# EAGLE design STM32USBInterface (EAGLE 9.6.2)
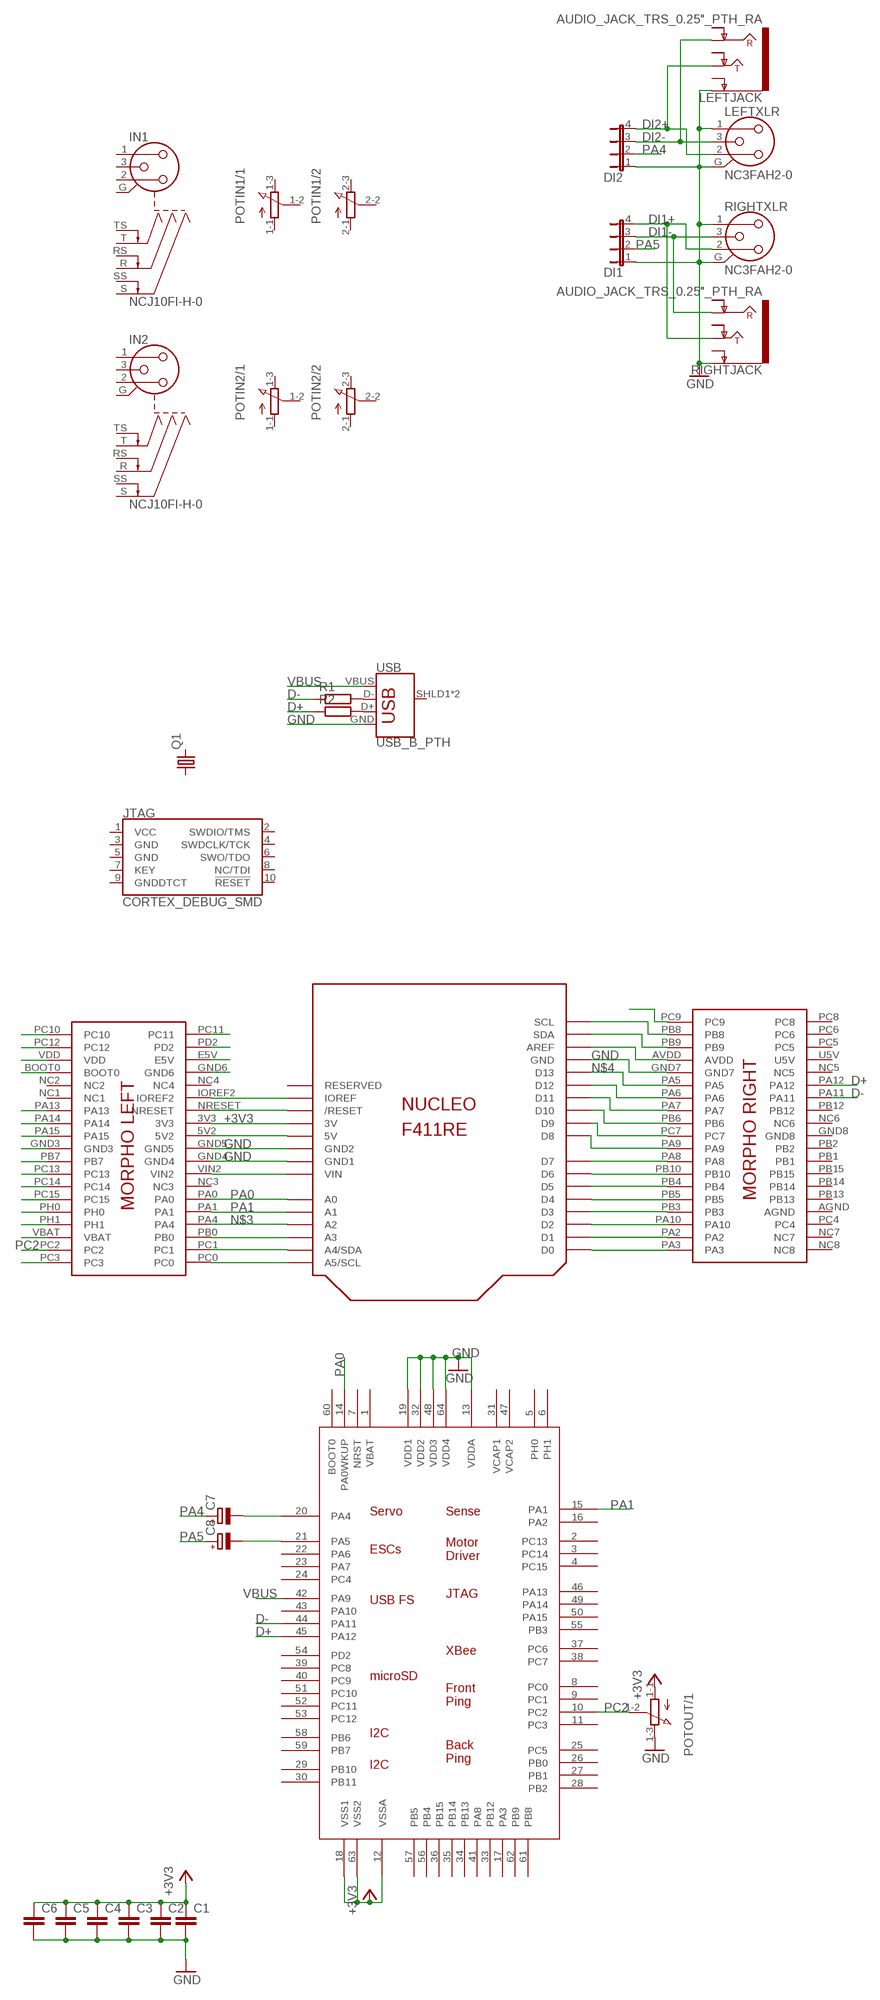
[diagram p0: schematic, sheet 1]

## Parts
C1  C-EUC0805  [C0805]
C2  C-EUC0805  [C0805]
C3  C-EUC0805  [C0805]
C4  C-EUC0805  [C0805]
C5  C-EUC0805  [C0805]
C6  C-EUC0805  [C0805]
C7  CPOL-EUE5-8.5  [E5-8,5]
C8  CPOL-EUE5-8.5  [E5-8,5]
DI1  JP4E  [JP4]
DI2  JP4E  [JP4]
IN1  NCJ10FI-H-0  [NCJ10FI-H-0]
IN2  NCJ10FI-H-0  [NCJ10FI-H-0]
JTAG  CORTEX_DEBUG_SMD  [SAMTECH_FTSH-105-01]
LEFTJACK  AUDIO_JACK_TRS_0.25"_PTH_RA  [AUDIO_JACK_0.25"_TRS_PTH_RA]
LEFTXLR  NC3FAH2-0  [NC3FAH2-0]
POTIN1  3RP/1610G  [3RP/1610G]
POTIN2  3RP/1610G  [3RP/1610G]
POTOUT  3RP/1610G  [3RP/1610G]
Q1  CRYSTALCTS406  [CTS406]
R1  R-EU_R0805  [R0805]
R2  R-EU_R0805  [R0805]
RIGHTJACK  AUDIO_JACK_TRS_0.25"_PTH_RA  [AUDIO_JACK_0.25"_TRS_PTH_RA]
RIGHTXLR  NC3FAH2-0  [NC3FAH2-0]
U$1  NUCLEO_F411RE  [NUCLEO_BRD64]
U$2  STM32F4R_64PIN_FOXCAR  [LQFP64]
USB  USB_B_PTH  [USB-B-PTH]

## Nets
+3V3: C1.1 C2.1 C3.1 C4.1 C5.1 C6.1 POTOUT.1-1(/1:A) U$1.3V U$1.3V3 U$2.12(VSSA) U$2.18(VSS1) U$2.63(VSS2)
D+: R2.1 U$1.PA12 U$2.45(PA12)
D-: R1.1 U$1.PA11 U$2.44(PA11)
DI1+: DI1.4 RIGHTJACK.TIP RIGHTXLR.2
DI1-: DI1.3 RIGHTJACK.RING RIGHTXLR.3
DI2+: DI2.4 LEFTJACK.TIP LEFTXLR.2
DI2-: DI2.3 LEFTJACK.RING LEFTXLR.3
GND: C1.2 C2.2 C3.2 C4.2 C5.2 C6.2 DI1.1 DI2.1 LEFTJACK.SLEEVE(EARTH) LEFTXLR.1 LEFTXLR.G POTOUT.1-3(/1:E) RIGHTJACK.SLEEVE(EARTH) RIGHTXLR.1 RIGHTXLR.G U$1.GND U$1.GND1 U$1.GND2 U$1.GND4 U$1.GND5 U$1.GND7 U$2.13(VDDA) U$2.19(VDD1) U$2.32(VDD2) U$2.48(VDD3) U$2.64(VDD4) USB.GND
N$1: R1.2 USB.D-
N$2: R2.2 USB.D+
N$3: C7.- U$1.A2 U$1.PA4 U$2.20(PA4)
N$4: C8.- U$1.D13 U$1.PA5 U$2.21(PA5)
N$6: U$1.A3 U$1.PB0
N$7: U$1.A4(A4/SDA) U$1.PC1
N$8: U$1.A5(A5/SCL) U$1.PC0
N$9: U$1.VIN U$1.VIN2
N$12: U$1.5V U$1.5V2
N$14: U$1.NRESET U$1.RESET(/RESET)
N$15: U$1.IOREF U$1.IOREF2
N$16: U$1.D0 U$1.PA3
N$17: U$1.D1 U$1.PA2
N$18: U$1.D2 U$1.PA10
N$19: U$1.D3 U$1.PB3
N$20: U$1.D4 U$1.PB5
N$21: U$1.D5 U$1.PB4
N$22: U$1.D6 U$1.PB10
N$23: U$1.D7 U$1.PA8
N$24: U$1.D8 U$1.PA9
N$25: U$1.D9 U$1.PC7
N$26: U$1.D10 U$1.PB6
N$27: U$1.D11 U$1.PA7
N$28: U$1.D12 U$1.PA6
N$31: U$1.AREF U$1.AVDD
N$32: U$1.PB9 U$1.SDA
N$33: U$1.PB8 U$1.SCL
N$34: U$1.PC9
N$35: U$1.GND6
N$36: U$1.E5V
N$37: U$1.PD2
N$38: U$1.PC11
N$39: U$1.PC10
N$40: U$1.PC12
N$41: U$1.VDD
N$42: U$1.BOOT0
N$43: U$1.PA13
N$44: U$1.PA14
N$45: U$1.PA15
N$46: U$1.GND3
N$47: U$1.PB7
N$48: U$1.PC13
N$49: U$1.PC14
N$50: U$1.PC15
N$51: U$1.PH0
N$52: U$1.PH1
N$53: U$1.VBAT
N$55: U$1.PC3
PA0: U$1.A0 U$1.PA0 U$2.14(PA0WKUP)
PA1: U$1.A1 U$1.PA1 U$2.15(PA1)
PA4: C7.+ DI2.2
PA5: C8.+ DI1.2
PC2: POTOUT.1-2(/1:S) U$1.PC2 U$2.10(PC2)
VBUS: U$2.42(PA9) USB.VBUS
Unconnected: IN1.1 IN1.2 IN1.3 IN1.G IN1.R IN1.RS IN1.S IN1.SS IN1.T IN1.TS IN2.1 IN2.2 IN2.3 IN2.G IN2.R IN2.RS IN2.S IN2.SS IN2.T IN2.TS JTAG.1(VCC) JTAG.2(SWDIO/TMS) JTAG.3(GND) JTAG.4(SWDCLK/TCK) JTAG.5(GND) JTAG.6(SWO/TDO) JTAG.7(KEY) JTAG.8(NC/TDI) JTAG.9(GNDDTCT) JTAG.10(!RESET) LEFTJACK.RING-NORM LEFTJACK.SLEEVE-NORM(EARTH-NORM) LEFTJACK.TIP-NORM POTIN1.1-1(/1:A) POTIN1.1-2(/1:S) POTIN1.1-3(/1:E) POTIN1.2-1(/2:A) POTIN1.2-2(/2:S) POTIN1.2-3(/2:E) POTIN2.1-1(/1:A) POTIN2.1-2(/1:S) POTIN2.1-3(/1:E) POTIN2.2-1(/2:A) POTIN2.2-2(/2:S) POTIN2.2-3(/2:E) POTOUT.2-1(/2:A) POTOUT.2-2(/2:S) POTOUT.2-3(/2:E) Q1.1 Q1.3 RIGHTJACK.RING-NORM RIGHTJACK.SLEEVE-NORM(EARTH-NORM) RIGHTJACK.TIP-NORM U$1.NC1 U$1.NC2 U$1.NC3 U$1.NC4 U$1.NC5 U$1.NC6 U$1.NC7 U$1.NC8 U$1.PB1 U$1.PB2 U$1.PB12 U$1.PB13 U$1.PB14 U$1.PB15 U$1.PC4 U$1.PC5 U$1.PC6 U$1.PC8 U$1.RESERVED U$2.1(VBAT) U$2.2(PC13) U$2.3(PC14) U$2.4(PC15) U$2.5(PH0) U$2.6(PH1) U$2.7(NRST) U$2.8(PC0) U$2.9(PC1) U$2.11(PC3) U$2.16(PA2) U$2.17(PA3) U$2.22(PA6) U$2.23(PA7) U$2.24(PC4) U$2.25(PC5) U$2.26(PB0) U$2.27(PB1) U$2.28(PB2) U$2.29(PB10) U$2.30(PB11) U$2.31(VCAP1) U$2.33(PB12) U$2.34(PB13) U$2.35(PB14) U$2.36(PB15) U$2.37(PC6) U$2.38(PC7) U$2.39(PC8) U$2.40(PC9) U$2.41(PA8) U$2.43(PA10) U$2.46(PA13) U$2.47(VCAP2) U$2.49(PA14) U$2.50(PA15) U$2.51(PC10) U$2.52(PC11) U$2.53(PC12) U$2.54(PD2) U$2.55(PB3) U$2.56(PB4) U$2.57(PB5) U$2.58(PB6) U$2.59(PB7) U$2.60(BOOT0) U$2.61(PB8) U$2.62(PB9) USB.SHLD1(SHIELD) USB.SHLD2(SHIELD)

## Power pins joined to a net without a drawn wire
AGND: U$1.AGND
GND8: U$1.GND8
U5V: U$1.U5V

## Library data of the parts
C1-C6 = resistor:C-EU: CAPACITOR, European symbol
C7 C8 = resistor:CPOL-EU: POLARIZED CAPACITOR, European symbol
DI1 DI2 = jumper:JP4E: JUMPER
IN1 IN2 = con-neutrik_ag:NCJ10FI-: Neutrik Audio Connector XLR SERIES Stereo 1/4" jack with switch Source: www.neutrik.com/; MPN: NCJ10FI-H-0; OC_FARNELL: unknown; OC_NEWARK: 99B1398
JTAG = SparkFun-Connectors:CORTEX_DEBUG: Cortex Debug Connector - 10 pin Supports JTAG debug, Serial Wire debug, and Serial Wire Viewer. PTH and SMD connector options available. General Connector Information <http://infocenter.arm.com/help/topic/com.arm.doc.faqs/attached/13634/cortex_debug_connectors.pdf> Products: PTH Connector <http://www.digikey.com/product-detail/en/cnc-tech/3220-10-0100-00/1175-1627-ND/3883661> -via Digi-Key SparkFun PSoc <https://www.sparkfun.com/products/13229> SparkFun T <https://www.sparkfun.com/products/13810>
LEFTJACK RIGHTJACK = SparkFun-Connectors:AUDIO_JACK_TRS_0.25"_PTH_RA: Audio Jack, 1/4" TRS jack, horizontal, PTH, aka "Phono jack" Find the connector here: Audio Jack - 1/4" Stereo (right angle) <https://www.sparkfun.com/products/11144> (COM-11144) Datasheet <http://cdn.sparkfun.com/datasheets/Components/General/JP-611%20DD.jpg> Note, although the datasheet and physical part are slightly different, this footprint was proven to mate well on the Proto Pedal. This device is used on these SparkFun Products: SparkFun TRS Jack Breakout - 1/4" Stereo <https://www.sparkfun.com/products/13005> (BOB-13005 ) SparkFun Proto Pedal - sorry bad link - product comming soon! <https://www.sparkfun.com/products/13124> (PRT-13124); PROD_ID: CONN-12339; SF_ID: COM-11144
LEFTXLR RIGHTXLR = con-neutrik_ag:NC3: Neutrik Audio Connector XLR SERIES Stereo 1/4" jack Source: www.neutrik.com/; MPN: NC3FAH-2-0; OC_FARNELL: unknown; OC_NEWARK: 11J5829
POTIN1 POTIN2 POTOUT = pot:3RP/1610G: 16mm Potentiometer two level Source: http://www.alphapotentiometers.net/html/16mm_pot_2.html
Q1 = crystal:CRYSTAL: CRYSTAL; OC_FARNELL: unknown; OC_NEWARK: unknown
R1 R2 = resistor:R-EU_: RESISTOR, European symbol
U$1 = Stm32nucleo:NUCLEO_F411RE
U$2 = stm32f4:STM32F4R_64PIN_FOXCAR: 64-pin STM32F4 chip with symbol for Foxcar Control Board v1.
USB = SparkFun-Connectors:USB_B: USB Type B Connector SparkFun Products: SparkFun Stepoko <https://www.sparkfun.com/products/13899> PTH; PROD_ID: CONN-08278; SF_ID: PRT-00139

## Board
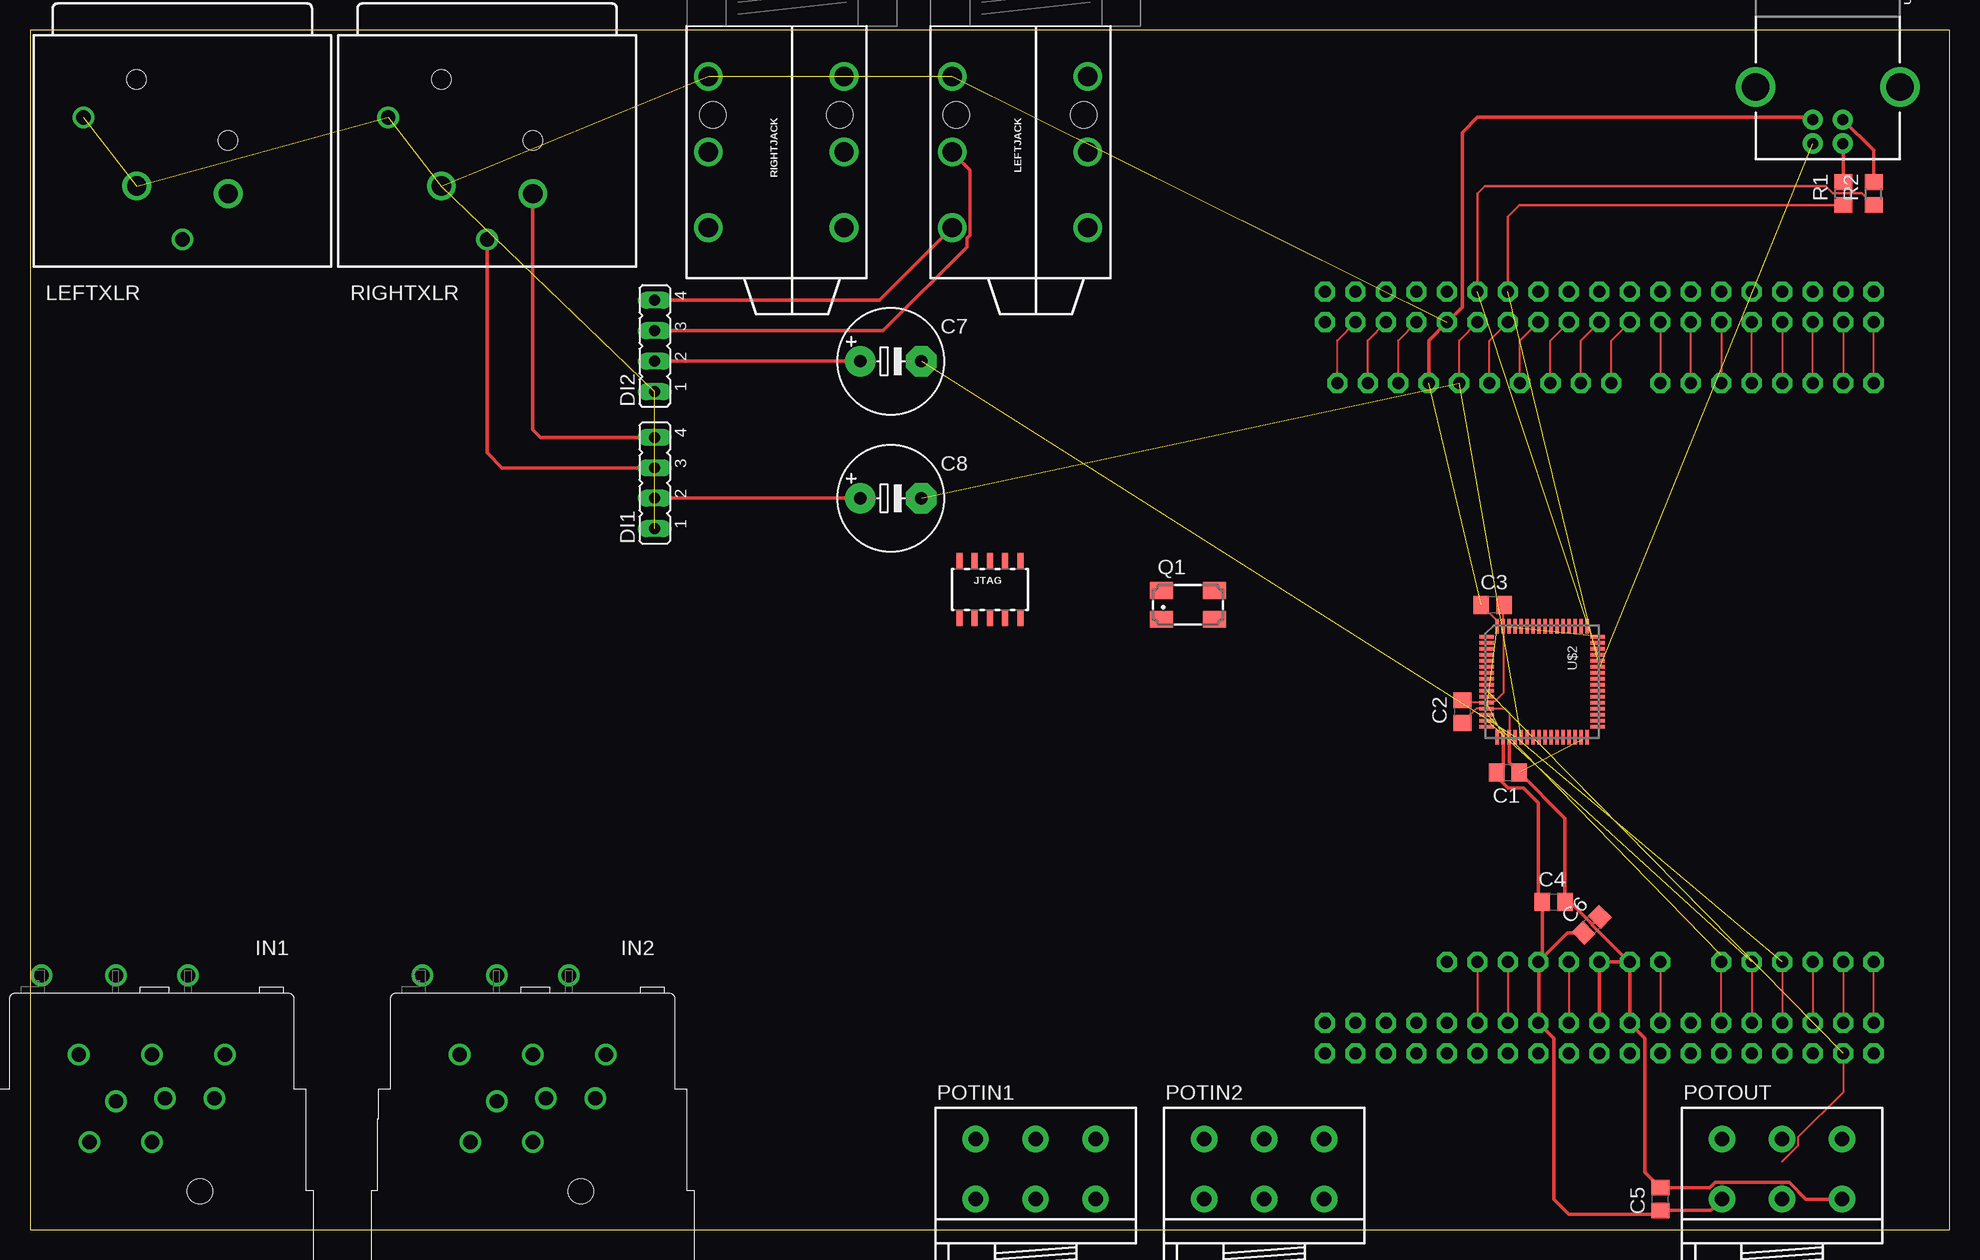
[diagram p1: board, top side]
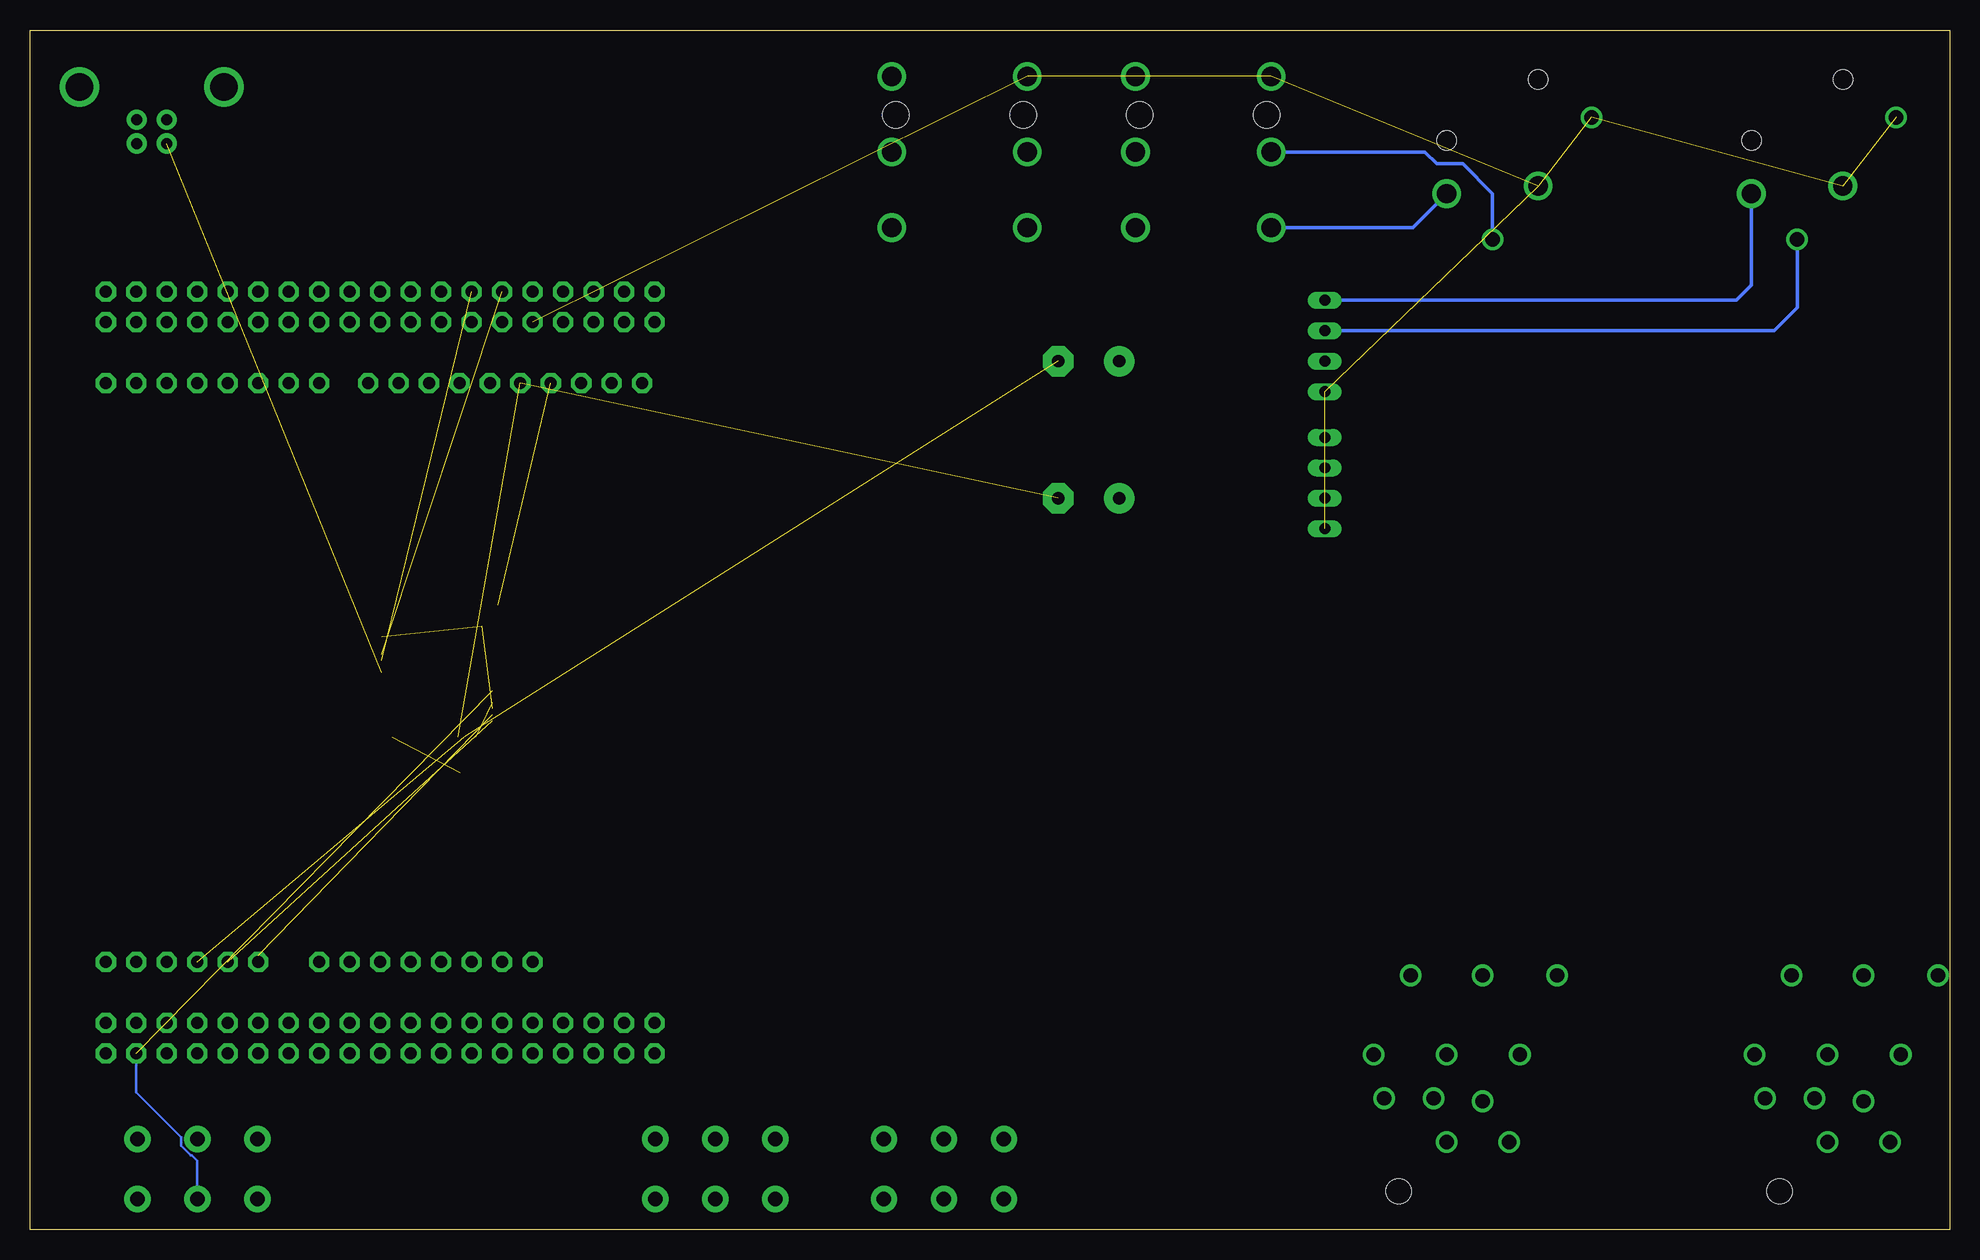
[diagram p2: board, bottom side, seen from below]

Size 160 x 100 mm. Coordinates in mm from the lower left corner, seen from the top.
Outline: 0,0 160,0 160,100 0,100 0,0
Copper layers (1*16): Top 0.035mm / dielectric 1.5mm / Bottom 0.035mm
Design rules "default": minimum track width 6mil, minimum drill 0.35mm, track to track 6mil, track to pad 6mil, pad to pad 6mil, via to via 6mil, smd to smd 6mil, copper to edge 40mil, drill to drill 6mil, minimum pad ring 10mil, minimum via ring 8mil, stop-mask expansion 4mil, vias tented up to drill 0mil, thermal gap 10mil

### Footprints (pad centres in the part's own frame; a part is rotated, then mirrored left to right if it is on the bottom)
C0805 = smd 1.3 x 1.5: 1 -0.95,0; 2 0.95,0
E5-8,5 = drill 1.016 pad 2.54: + -2.54,0 | drill 1.016 pad 2.54 octagon: - 2.54,0
JP4 = drill 0.914 long: 1 -3.81,0; 2 -1.27,0; 3 1.27,0; 4 3.81,0
NCJ10FI-H-0 = drill 1.2: 1 -6.1,-18.4; 2 6.1,-18.4; 3 0,-18.4; G 0,-11.1; GN -1.1,-14.75; R -5.2,-14.75; RS -3,-25; S 5.2,-11.1; SS 3,-14.5; T 9.2,-25; TS 3,-25 | hole 2.1: -4,-7
SAMTECH_FTSH-105-01 = smd 0.508 x 1.27: 1 -2.54,-2.413; 2 -2.54,2.413; 3 -1.27,-2.413; 4 -1.27,2.413; 5 0,-2.413; 6 0,2.413; 7 1.27,-2.413; 8 1.27,2.413; 9 2.54,-2.413; 10 2.54,2.413
AUDIO_JACK_0.25"_TRS_PTH_RA = drill 1.6: RING 10.5,-6.95; RING-NORM 10.5,4.35; SLEEVE 4.2,-6.95; SLEEVE-NORM 4.2,4.35; TIP 16.8,-6.95; TIP-NORM 16.8,4.35 | hole 2.2: 7.4,4; 7.4,-6.6
NC3FAH2-0 = drill 1.6: 1 -3.81,0.635; 2 3.81,0 | drill 1.2: 3 0,-3.815; G -8.25,6.355 | hole 1.6: -3.81,9.525; 3.81,4.445
3RP/1610G = drill 1.2 pad 2.184: 1-1 -5,0; 1-2 0,0; 1-3 5,0; 2-1 -5,5; 2-2 0,5; 2-3 5,5
CTS406 = smd 1.9 x 1.4: 1 -2.2,-1.2; 2 2.2,-1.2; 3 2.2,1.2; 4 -2.2,1.2
R0805 = smd 1.3 x 1.5: 1 -0.95,0; 2 0.95,0
NUCLEO_BRD64 = drill 1 pad 1.676 octagon: 3V 10.87,33.02; 3V3 5.79,33.02; 5V 10.87,30.48; 5V2 5.79,30.48; A0 10.87,17.78; A1 10.87,15.24; A2 10.87,12.7; A3 10.87,10.16; A4 10.87,7.62; A5 10.87,5.08; AGND 66.75,12.7; AREF 59.13,44.704; AVDD 64.21,43.18; BOOT0 3.25,43.18; D0 59.13,5.08; D1 59.13,7.62; D2 59.13,10.16; D3 59.13,12.7; D4 59.13,15.24; D5 59.13,17.78; D6 59.13,20.32; D7 59.13,22.86; D8 59.13,26.924; D9 59.13,29.464; D10 59.13,32.004; D11 59.13,34.544; D12 59.13,37.084; D13 59.13,39.624; E5V 5.79,45.72; GND 59.13,42.164; GND1 10.87,25.4; GND2 10.87,27.94; GND3 3.25,27.94; GND4 5.79,25.4; GND5 5.79,27.94; GND6 5.79,43.18; GND7 64.21,40.64; GND8 66.75,27.94; IOREF 10.87,38.1; IOREF2 5.79,38.1; NC1 3.25,38.1; NC2 3.25,40.64; NC3 5.79,20.32; NC4 5.79,40.64; NC5 66.75,40.64; NC6 66.75,30.48; NC7 66.75,7.62; NC8 66.75,5.08; NRESET 5.79,35.56; PA0 5.79,17.78; PA1 5.79,15.24; PA2 64.21,7.62; PA3 64.21,5.08; PA4 5.79,12.7; PA5 64.21,38.1; PA6 64.21,35.56; PA7 64.21,33.02; PA8 64.21,22.86; PA9 64.21,25.4; PA10 64.21,10.16; PA11 66.75,35.56; PA12 66.75,38.1; PA13 3.25,35.56; PA14 3.25,33.02; PA15 3.25,30.48; PB0 5.79,10.16; PB1 66.75,22.86; PB2 66.75,25.4; PB3 64.21,12.7; PB4 64.21,17.78; PB5 64.21,15.24; PB6 64.21,30.48; PB7 3.25,25.4; PB8 64.21,48.26; PB9 64.21,45.72; PB10 64.21,20.32; PB12 66.75,33.02; PB13 66.75,15.24; PB14 66.75,17.78; PB15 66.75,20.32; PC0 5.79,5.08; PC1 5.79,7.62; PC2 3.25,7.62; PC3 3.25,5.08; PC4 66.75,10.16; PC5 66.75,45.72; PC6 66.75,48.26; PC7 64.21,27.94; PC8 66.75,50.8; PC9 64.21,50.8; PC10 3.25,50.8; PC11 5.79,50.8; PC12 3.25,48.26; PC13 3.25,22.86; PC14 3.25,20.32; PC15 3.25,17.78; PD2 5.79,48.26; PH0 3.25,15.24; PH1 3.25,12.7; RESERVED 10.87,40.64; RESET 10.87,35.56; SCL 59.13,49.784; SDA 59.13,47.244; U5V 66.75,43.18; VBAT 3.25,10.16; VDD 3.25,45.72; VIN 10.87,22.86; VIN2 5.79,22.86
LQFP64 = smd 0.3 x 1.2: 1 -3.7,-4.3; 2 -3.2,-4.3; 3 -2.7,-4.3; 4 -2.2,-4.3; 5 -1.7,-4.3; 6 -1.2,-4.3; 7 -0.7,-4.3; 8 -0.2,-4.3; 9 0.3,-4.3; 10 0.8,-4.3; 11 1.3,-4.3; 12 1.8,-4.3; 13 2.3,-4.3; 14 2.8,-4.3; 15 3.3,-4.3; 16 3.8,-4.3; 33 3.8,4.95; 34 3.3,4.95; 35 2.8,4.95; 36 2.3,4.95; 37 1.8,4.95; 38 1.3,4.95; 39 0.8,4.95; 40 0.3,4.95; 41 -0.2,4.95; 42 -0.7,4.95; 43 -1.2,4.95; 44 -1.7,4.95; 45 -2.2,4.95; 46 -2.7,4.95; 47 -3.2,4.95; 48 -3.7,4.95 | smd 1.2 x 0.3: 17 4.675,-3.425; 18 4.675,-2.925; 19 4.675,-2.425; 20 4.675,-1.925; 21 4.675,-1.425; 22 4.675,-0.925; 23 4.675,-0.425; 24 4.675,0.075; 25 4.675,0.575; 26 4.675,1.075; 27 4.675,1.575; 28 4.675,2.075; 29 4.675,2.575; 30 4.675,3.075; 31 4.675,3.575; 32 4.675,4.075; 49 -4.575,4.075; 50 -4.575,3.575; 51 -4.575,3.075; 52 -4.575,2.575; 53 -4.575,2.075; 54 -4.575,1.575; 55 -4.575,1.075; 56 -4.575,0.575; 57 -4.575,0.075; 58 -4.575,-0.425; 59 -4.575,-0.925; 60 -4.575,-1.425; 61 -4.575,-1.925; 62 -4.575,-2.425; 63 -4.575,-2.925; 64 -4.575,-3.425
USB-B-PTH = drill 0.914 pad 1.676: D+ 4,1.25; D- 5.981,1.25; GND 4,-1.25; VBUS 5.981,-1.25 | drill 2.286: SHLD1 1.282,-6.02; SHLD2 1.282,6.02

### Placement (x,y rotation side)
C1  123.19,38.1 0 top
C2  119.38,43.18 270 top
C3  121.92,52.07 180 top
C4  127,27.3 0 top
C5  135.89,2.54 90 top
C6  130.18,25.4 45 top
C7  71.75,72.39 0 top
C8  71.75,60.96 0 top
DI1  52.07,62.23 90 top
DI2  52.07,73.66 90 top
IN1  10.16,-3.81 180 top
IN2  41.91,-3.81 180 top
JTAG  80.01,53.34 0 top
LEFTJACK  83.82,100.33 270 top
LEFTXLR  12.7,86.36 0 top
POTIN1  83.82,2.54 0 top
POTIN2  102.87,2.54 0 top
POTOUT  146.05,2.54 0 top
Q1  96.52,52.07 0 top
R1  151.13,86.36 90 top
R2  153.67,86.36 90 top
RIGHTJACK  63.5,100.33 270 top
RIGHTXLR  38.1,86.36 0 top
U$1  158.75,11.43 90 top
U$2  125.73,45.72 270 top
USB  149.86,96.52 270 top

### Tracks (layer width: path | path; a pad name or v marks a point on that pad's centre or on a via)
+3V3  (1 unrouted)
  Top 0.152: U$1.3V 125.73,22.23 | 125.73,22.23 U$1.3V3 125.77,17.18 127,15.95 | C2.1 119.59,43.92 U$2.12 121.55,44.04 122.12,44.04 122.81,44.72 U$2.63 122.81,52.01 C3.1 | 135.73,1.43 C5.1 | 128.27,24.73 128.23,24.73 125.73,22.23
  Top 0.305: U$2.18 122.81,38.66 C1.1 122.24,37.78 123.19,36.83 124.46,36.83 125.73,35.56 125.73,27.62 C4.1 126.05,22.62 U$1.3V | U$1.3V 125.77,22.26 125.77,17.18 | U$1.3V 128.16,24.73 128.27,24.73 C6.1 | U$1.3V3 127,15.95 127,2.54 128.27,1.27 135.57,1.27 135.73,1.43 | POTOUT.1-1 140.1,1.59 C5.1
D+  (1 unrouted)
  Top 0.203: U$1.PA12 120.65,86.36 121.28,87 149.69,87 150.28,86.41 152.67,86.41 R2.1
D-  (1 unrouted)
  Top 0.203: U$1.PA11 123.19,84.45 124.14,85.41 R1.1
DI1+
  Top 0.305: RIGHTXLR.2 41.91,66.67 42.55,66.04 DI1.4
  Bottom 0.305: RIGHTJACK.TIP 44.74,83.53 RIGHTXLR.2
DI1-
  Top 0.305: RIGHTXLR.3 38.1,64.77 39.37,63.5 DI1.3
  Bottom 0.305: RIGHTJACK.RING 43.72,89.83 42.73,88.84 40.58,88.84 38.1,86.36 RIGHTXLR.3
DI2+
  Top 0.305: LEFTJACK.TIP 70.81,77.47 DI2.4
  Bottom 0.305: LEFTXLR.2 16.51,78.74 17.78,77.47 35.56,77.47 DI2.4
DI2-
  Top 0.305: LEFTJACK.RING 78.38,88.33 78.38,82.91 78.11,82.64 78.11,81.92 71.12,74.93 DI2.3
  Bottom 0.305: LEFTXLR.3 12.7,76.83 14.61,74.93 DI2.3
GND  (12 unrouted)
  Top 0.152: 133.35,22.23 U$1.GND1 130.21,25.44 | 123.98,38.26 C1.2 | C2.2 120.57,43.42 U$2.13 122.95,43.42 123.31,43.06 U$2.19 | U$2.64 122.31,50.73 C3.2
  Top 0.305: USB.GND 148.42,92.71 120.65,92.71 119.38,91.44 119.38,76.91 U$1.GND7 116.59,74.12 U$1.GND | U$2.19 123.31,38.94 123.98,38.26 | C1.2 127.95,34.29 C4.2 128.34,27.3 130.21,25.44 | 130.21,25.44 C6.2 | 130.21,25.44 130.21,25.37 130.8,24.78 133.28,22.3 | 133.28,22.3 U$1.GND2 U$1.GND5 | 133.28,22.3 133.35,22.23 U$1.GND4 134.62,15.95 134.62,4.76 C5.2 140.02,3.49 140.47,3.94 146.63,3.94 148.03,2.54 POTOUT.1-3
N$1
  Top 0.305: USB.D- 151.13,90.52 R1.2
N$2
  Top 0.152: 153.67,87.63 R2.2
  Top 0.305: USB.D+ 153.67,89.96 153.67,87.63
N$3  (2 unrouted)
  Top 0.152: U$1.A2 U$1.PA4
N$4  (2 unrouted)
  Top 0.152: U$1.D13 119.13,74.12 U$1.PA5
N$6
  Top 0.152: U$1.A3 U$1.PB0
N$7
  Top 0.152: U$1.A4 U$1.PC1
N$8
  Top 0.152: U$1.PC0 U$1.A5
N$9
  Top 0.152: U$1.VIN U$1.VIN2
N$12
  Top 0.152: U$1.5V U$1.5V2
N$14
  Top 0.152: U$1.RESET U$1.NRESET
N$15
  Top 0.152: U$1.IOREF U$1.IOREF2
N$16
  Top 0.152: U$1.D0 U$1.PA3
N$17
  Top 0.152: U$1.PA2 U$1.D1
N$18
  Top 0.152: U$1.D2 U$1.PA10
N$19
  Top 0.152: U$1.PB3 U$1.D3
N$20
  Top 0.152: U$1.D4 U$1.PB5
N$21
  Top 0.152: U$1.PB4 U$1.D5
N$22
  Top 0.152: U$1.D6 U$1.PB10
N$23
  Top 0.152: U$1.PA8 U$1.D7
N$24
  Top 0.152: U$1.D8 131.83,74.12 U$1.PA9
N$25
  Top 0.152: U$1.D9 129.29,74.12 U$1.PC7
N$26
  Top 0.152: U$1.D10 126.75,74.12 U$1.PB6
N$27
  Top 0.152: U$1.D11 124.21,74.12 U$1.PA7
N$28
  Top 0.152: U$1.D12 121.67,74.12 U$1.PA6
N$31
  Top 0.152: U$1.AREF 114.05,74.12 U$1.AVDD
N$32
  Top 0.152: U$1.SDA 111.51,74.12 U$1.PB9
N$33
  Top 0.152: U$1.SCL 108.97,74.12 U$1.PB8
PA0  (1 unrouted)
  Top 0.152: U$1.PA0 U$1.A0 140.97,22.86
PA1  (1 unrouted)
  Top 0.152: U$1.A1 U$1.PA1
PA4
  Top 0.305: DI2.2 C7.+
PA5
  Top 0.305: C8.+ DI1.2
PC2  (1 unrouted)
  Top 0.152: U$1.PC2 151.13,11.43 147.37,7.67 147.37,6.99 146.05,5.67
  Bottom 0.203: POTOUT.1-2 146.05,5.71 146.53,6.19 146.61,6.19 147.4,6.98 147.4,7.7 151.13,11.43 U$1.PC2
VBUS  (1 unrouted)